# Altium schematic sheet 10 UART&I2C.SchDoc
size 420 x 297 mm
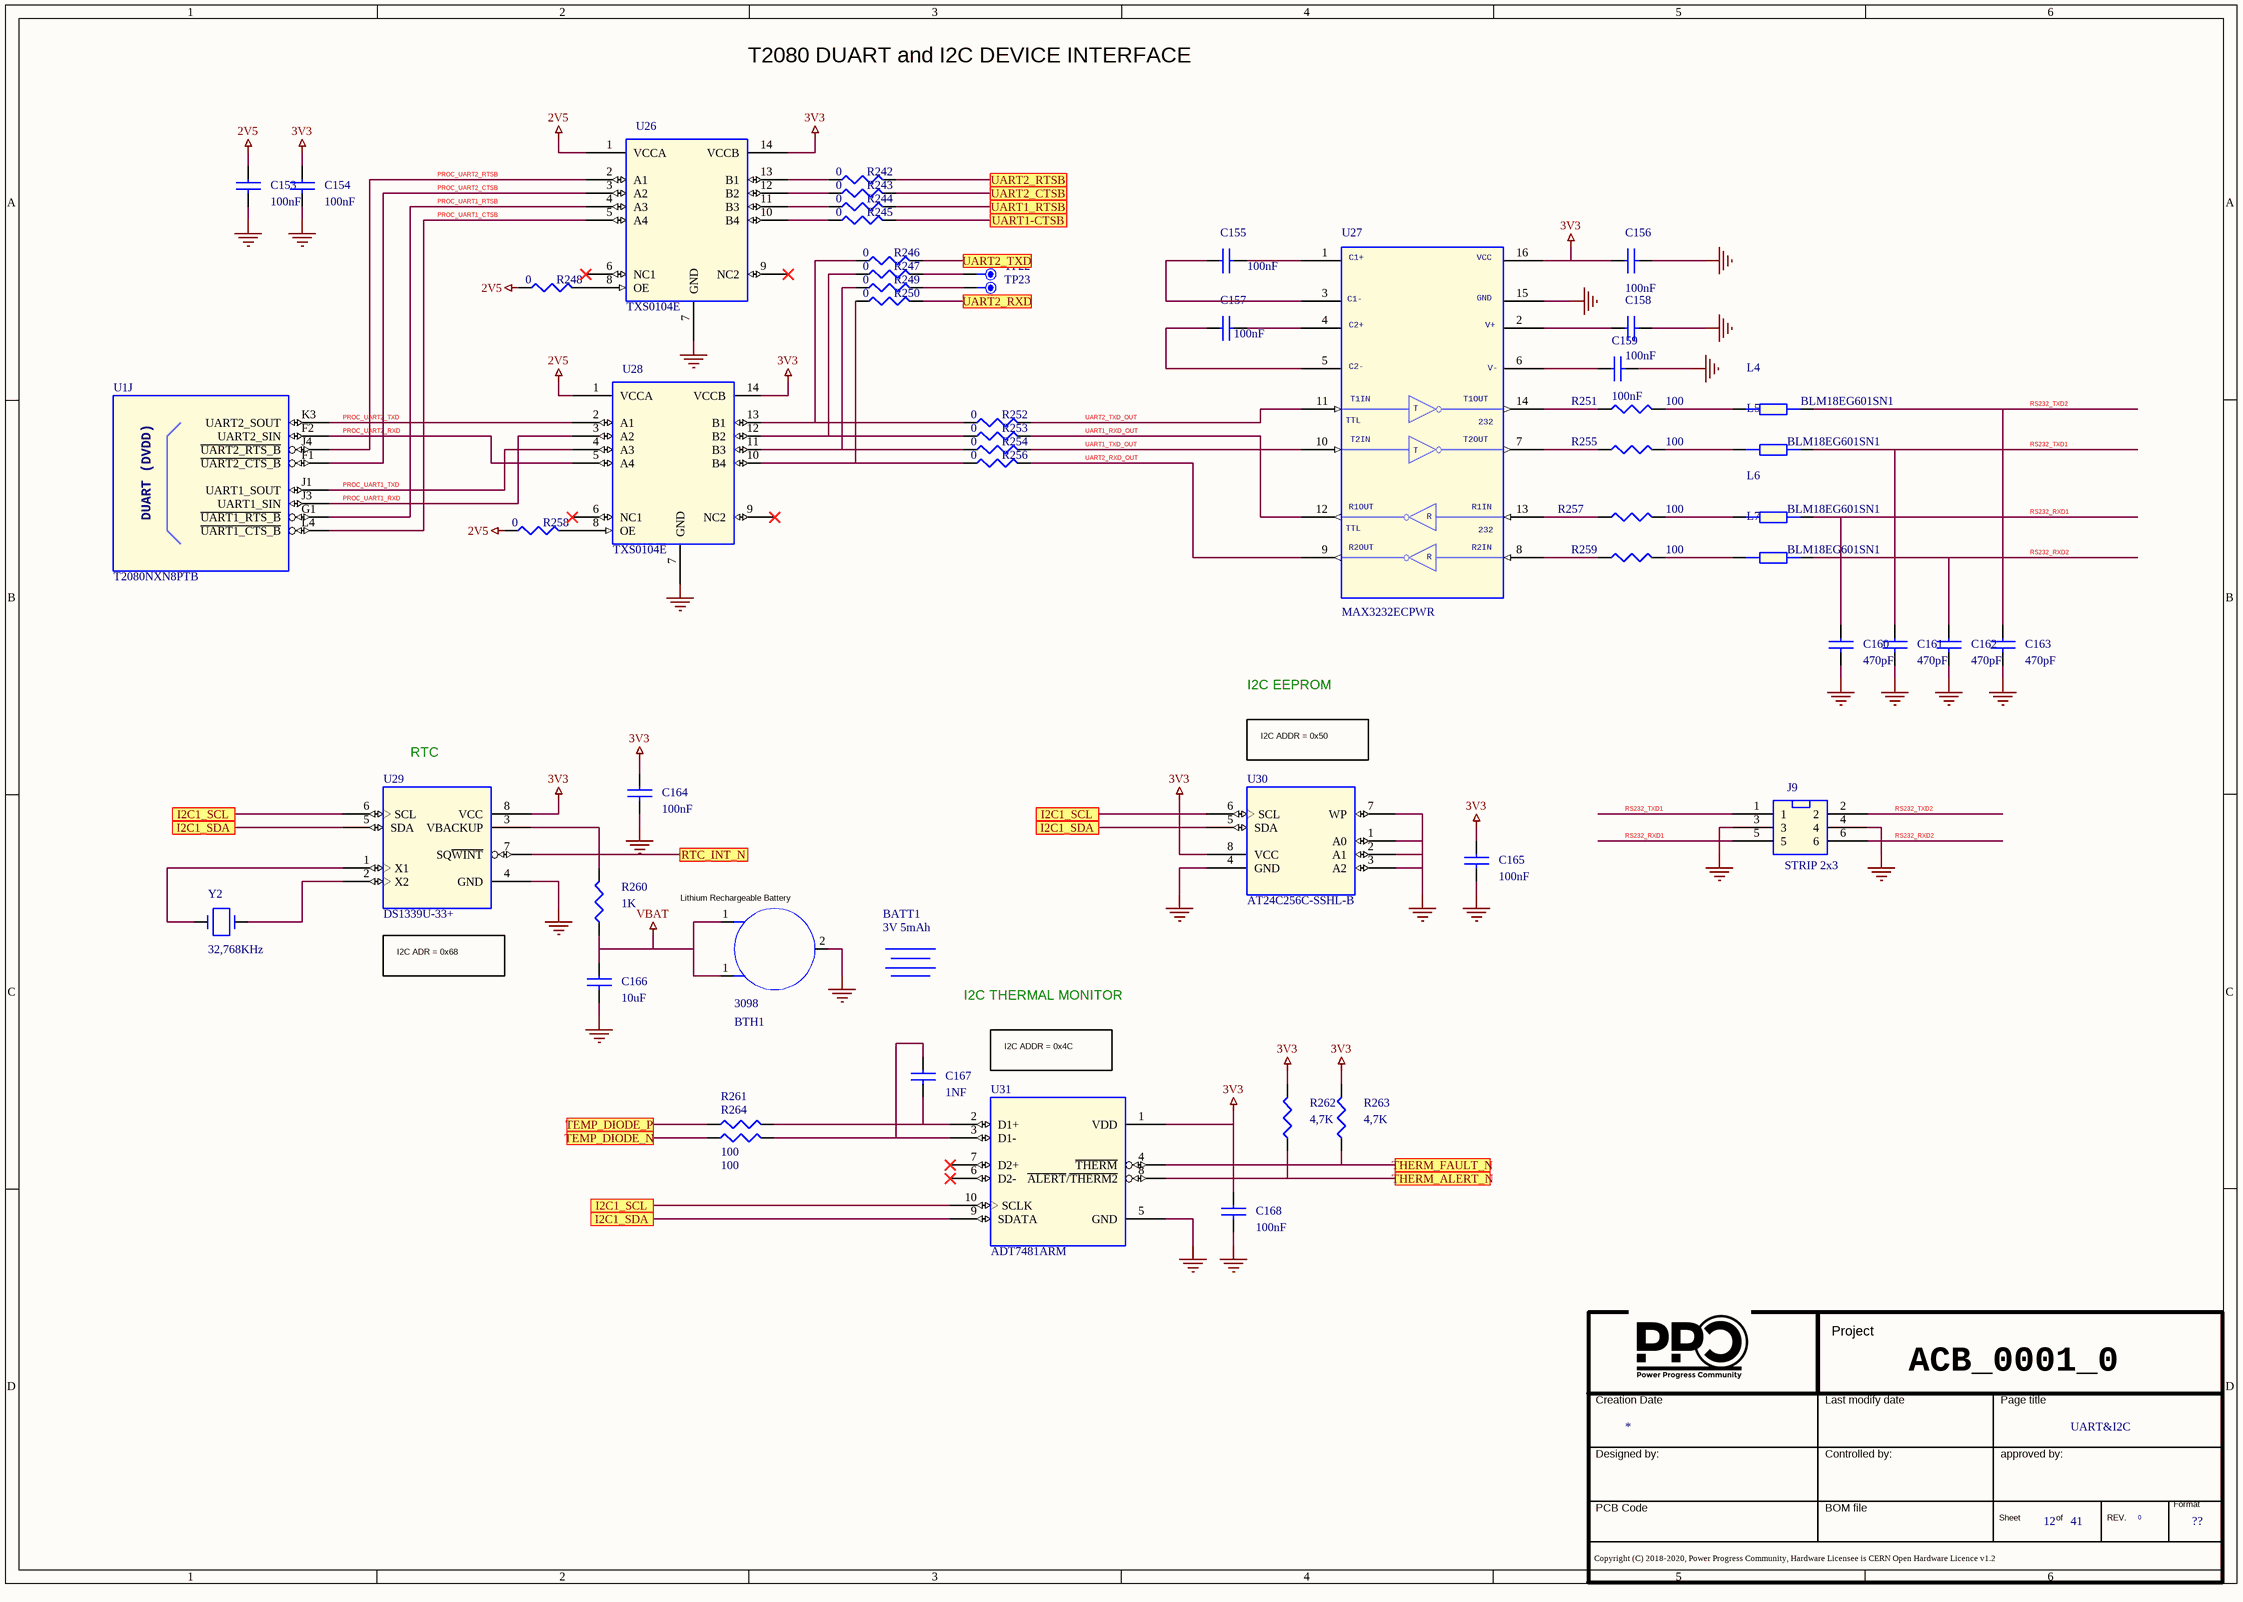
[diagram p0: 10 UART&I2C.SchDoc]

## Parts
*  Doc: UART&I2C  Page Count: 41  Page Number: 12  Page Size: ??  RevCode: 0  (hidden comment: Title_block_PPC)  (graphical)
BATT1  3V 5mAh
BTH1  3098  [SMD 3 PIN]
C153  100nF  [SMD_0402]
C154  100nF  [SMD_0402]
C155  100nF  [SMD_0402]
C156  100nF  [SMD_0402]
C157  100nF  [SMD_0402]
C158  100nF  [SMD_0402]
C159  100nF  [SMD_0402]
C160  470pF  [SMD_0402]
C161  470pF  [SMD_0402]
C162  470pF  [SMD_0402]
C163  470pF  [SMD_0402]
C164  100nF  [SMD_0402]
C165  100nF  [SMD_0402]
C166  10uF  [SMD_0603]
C167  1NF  [SMD_0402]
C168  100nF  [SMD_0402]
J9  STRIP 2x3  [SMT]
L4  BLM18EG601SN1  [SMD_0603]
L5  BLM18EG601SN1  [SMD_0603]
L6  BLM18EG601SN1  [SMD_0603]
L7  BLM18EG601SN1  [SMD_0603]
R242  0  [SMD_0402]
R243  0  [SMD_0402]
R244  0  [SMD_0402]
R245  0  [SMD_0402]
R246  0  [SMD_0402]
R247  0  [SMD_0402]
R248  0  [SMD_0402]
R249  0  [SMD_0402]
R250  0  [SMD_0402]
R251  100  [SMD_0402]
R252  0  [SMD_0402]
R253  0  [SMD_0402]
R254  0  [SMD_0402]
R255  100  [SMD_0402]
R256  0  [SMD_0402]
R257  100  [SMD_0402]
R258  0  [SMD_0402]
R259  100  [SMD_0402]
R260  1K  [SMD_0402]
R261  100  [SMD_0402]
R262  4,7K  [SMD_0402]
R263  4,7K  [SMD_0402]
R264  100  [SMD_0402]
TP22  TPS  [TPS]  (value not drawn)
TP23  TPS  [TPS]  (value not drawn)
U1  T2080NXN8PTB  [bga]  (part J of 14)
U26  TXS0104E  [TSSOP14]
U27  MAX3232ECPWR  [TSSOP16]
U28  TXS0104E  [TSSOP14]
U29  DS1339U-33+  [USOP8]
U30  AT24C256C-SSHL-B  [so_8]
U31  ADT7481ARM  [msop_10]
Y2  32,768KHz  [SMD_3215]

## Ports
I2C1_SCL, I2C1_SDA, RTC_INT_N, TEMP_DIODE_N, TEMP_DIODE_P, THERM_ALERT_N, THERM_FAULT_N, UART1-CTSB, UART1_RTSB, UART2_CTSB, UART2_RTSB, UART2_RXD, UART2_TXD

## Nets
2V5: C153.1 R248.2 R258.2 U26.1(VCCA) U28.1(VCCA)
3V3: C154.1 C156.1 C164.1 C165.1 C168.1 R262.2 R263.2 U26.14(VCCB) U27.16(VCC) U28.14(VCCB) U29.8(VCC) U30.8(VCC) U31.1(VDD)
GND: BTH1.2(2NEG) C153.2 C154.2 C156.2 C158.2 C159.2 C160.2 C161.2 C162.2 C163.2 C164.2 C165.2 C166.2 C168.2 J9.3 J9.4 U26.7(GND) U27.15(GND) U28.7(GND) U29.4(GND) U30.1(A0) U30.2(A1) U30.3(A2) U30.4(GND) U30.7(WP) U31.5(GND)
VBAT: BTH1.1(1POS) C166.1 R260.1
I2C1_SCL: U29.6(SCL) U30.6(SCL) U31.10(SCLK) ; port I2C1_SCL
I2C1_SDA: U29.5(SDA) U30.5(SDA) U31.9(SDATA) ; port I2C1_SDA
PROC_UART1_CTSB: U1.L4(~{UART1_CTS_B}) U26.5(A4)
PROC_UART1_RTSB: U1.G1(~{UART1_RTS_B}) U26.4(A3)
PROC_UART1_RXD: U1.J3(UART1_SIN) U28.3(A2)
PROC_UART1_TXD: U1.J1(UART1_SOUT) U28.4(A3)
PROC_UART2_CTSB: U1.F1(~{UART2_CTS_B}) U26.3(A2)
PROC_UART2_RTSB: U1.J4(~{UART2_RTS_B}) U26.2(A1)
PROC_UART2_RXD: U1.F2(UART2_SIN) U28.5(A4)
PROC_UART2_TXD: U1.K3(UART2_SOUT) U28.2(A1)
RS232_RXD1: C160.1 J9.5 L6.2
RS232_RXD2: C162.1 J9.6 L7.2
RS232_TXD1: C161.1 J9.1 L5.2
RS232_TXD2: C163.1 J9.2 L4.2
RTC_INT_N: U29.7(SQ~{WINT}) ; port RTC_INT_N
TEMP_DIODE_N: R264.1 ; port TEMP_DIODE_N
TEMP_DIODE_P: R261.1 ; port TEMP_DIODE_P
THERM_ALERT_N: R262.1 U31.8(~{ALERT}/~{THERM2}) ; port THERM_ALERT_N
THERM_FAULT_N: R263.1 U31.4(~{THERM}) ; port THERM_FAULT_N
UART1-CTSB: R245.1 ; port UART1-CTSB
UART1_RTSB: R244.1 ; port UART1_RTSB
UART1_RXD_OUT: R253.1 U27.12
UART1_TXD_OUT: R254.1 U27.10
UART2_CTSB: R243.1 ; port UART2_CTSB
UART2_RTSB: R242.1 ; port UART2_RTSB
UART2_RXD: R250.1 ; port UART2_RXD
UART2_RXD_OUT: R256.1 U27.9
UART2_TXD: R246.1 ; port UART2_TXD
UART2_TXD_OUT: R252.1 U27.11
NetC155_1: C155.1 U27.3
NetC155_2: C155.2 U27.1
NetC157_1: C157.1 U27.5
NetC157_2: C157.2 U27.4
NetC158_1: C158.1 U27.2
NetC159_1: C159.1 U27.6
NetC167_1: C167.1 R264.2 U31.3(D1-)
NetC167_2: C167.2 R261.2 U31.2(D1+)
NetL4_1: L4.1 R251.2
NetL5_1: L5.1 R255.2
NetL6_1: L6.1 R257.2
NetL7_1: L7.1 R259.2
NetR242_2: R242.2 U26.13(B1)
NetR243_2: R243.2 U26.12(B2)
NetR244_2: R244.2 U26.11(B3)
NetR245_2: R245.2 U26.10(B4)
NetR246_2: R246.2 R252.2 U28.13(B1)
NetR247_1: R247.1 TP22.1
NetR247_2: R247.2 R253.2 U28.12(B2)
NetR248_1: R248.1 U26.8(OE)
NetR249_1: R249.1 TP23.1
NetR249_2: R249.2 R254.2 U28.11(B3)
NetR250_2: R250.2 R256.2 U28.10(B4)
NetR251_1: R251.1 U27.14
NetR255_1: R255.1 U27.7
NetR257_1: R257.1 U27.13
NetR258_1: R258.1 U28.8(OE)
NetR259_1: R259.1 U27.8
NetR260_2: R260.2 U29.3(VBACKUP)
NetU29_1: U29.1(X1) Y2.1
NetU29_2: U29.2(X2) Y2.2

Not connected (* = marked no-connect by the designer): U26 6(NC1)* 9(NC2)*; U28 6(NC1)* 9(NC2)*; U31 6(D2-)* 7(D2+)*

## Notes on the sheet
- T2080 DUART and I2C DEVICE INTERFACE
- I2C EEPROM
- (near U29) RTC
- I2C ADDR = 0x50
- (near BTH1) Lithium Rechargeable Battery
- I2C ADR = 0x68
- I2C THERMAL MONITOR
- I2C ADDR = 0x4C
- ACB_0001_0
- (in symbol MAX3232E) C1+; C1-; C2+; V+; C2-; V-; T1IN; T1OUT; T; TTL; 232; T2IN; T2OUT; R1OUT; R1IN; R; R2OUT; R2IN
- (in symbol T2080, part J) DUART (DVDD)
- (in symbol Title_block_PPC) Project; Creation Date; Last modify date; Page title; Designed by:; Controlled by:; approved by:; Format; PCB Code; BOM file; Sheet; of; REV.; Copyright (C) 2018-2020, Power Progress Community, Hardware Licensee is CERN Open Hardware Licence v1.2

## Library data of the parts
* = Title_block_PPC: Title: T2080PCIe; Schematic Page Count: 45; Schematic Page Number: 14; Author: MICETEK; Page Create Date: March  8, 1995; Page Title: ?; Page Modify Date: *
BATT1 = BATT_BUTTON: BATTERY LITHIUM COIN 3V 6.8mm Rechargable; Part Number: DA CODIFICARE; Manufacturer 1: Panasonic - BSG; Manufacturer Part Number 1: ML-621S/ZTN; Part Type: BATTERIA; Distributor 1: DIGIKEY (P007-ND)
BTH1 = BATT_HOLDER_PTH_1: HOLDER 6.8mm COIN CELL HLD SMD; Manufacturer 1: Keystone Electronics; Part Number: DA CODIFICARE; RSM: BATT-BH3098; Distributor 1: FARNELL (1889421); Manufacturer Part Number 1: 3098; Part Type: BATTHOLDER\SMD; Tecno77: BATT-BH3098; PCB Footprint: SMD 3 PIN
C153-C155 C158 C159 C165 C168 = CAP NP_Dup2: COND.CER. 100NF 50V 0402 X7R SMD; Manufacturer Part Number 1: CGA2B3X7R1H104M050BD; Manufacturer 1: TDK; Part Number: PASSIVE_24; RSM: RC0402; PCB Footprint: SMD_0402; Part Type: Capacitors\Ceramic\SMD\0402
C156 C157 C164 = CAP NP_Dup2: COND.CER. 100NF 50V 0402 X7R SMD; Part Number: PASSIVE_24; Manufacturer 1: TDK; Manufacturer Part Number 1: CGA2B3X7R1H104M050BD; RSM: RC0402; PCB Footprint: SMD_0402; Part Type: Capacitors\Ceramic\SMD\0402
C160-C163 = CAP NP_Dup2: COND.CER. 470PF 50V 0402 NPO SMD; Part Number: PASSIVE_83; Manufacturer 1: Murata; Manufacturer Part Number 1: GRM1555C1H471JA01D; RSM: RC0402; PCB Footprint: SMD_0402; Part Type: Capacitors\Ceramic\SMD\0402
C166 = CAP NP_Dup2: COND.CER.10uF 0603 25V SMD; Manufacturer Part Number 1: CL10A106MA8NRNC; Manufacturer 1: SAMSUNG; Part Number: PASSIVE_124; RSM: RC0603; PCB Footprint: SMD_0603; Part Type: Capacitors\Ceramic\SMD\0603
C167 = CAP NP_Dup2: COND.CER. 1NF 50V 0402 X7R SMD; Manufacturer Part Number 1: GRM15XR71H102KA86D; Manufacturer 1: Murata; Part Number: PASSIVE_47; RSM: RC0402; PCB Footprint: SMD_0402; Part Type: Capacitors\Ceramic\SMD\0402
J9 = HEADER_2x3: STRIP MASC.2x3P CS.p=2.54mm; Part Number: CONNECTORS_488; Manufacturer 1: TE CONNECTIVITY / AMP; Manufacturer Part Number 1: 9689567RL; PCB Footprint: 2.54mm; RSM: PIN-100MLS-6DL; Part Type: Strip\Terminal
L4 L5 L7 = FERRITE_BEAD: FERRITE BEAD 600ohm 500mA 0603 SMD; Manufacturer Part Number 1: BLM18EG601SN1 SMD; Manufacturer 1: Murata; Part Number: PASSIVE_377; RSM: RC0603; PCB Footprint: SMD_0603; Part Type: Ferrite Beads\SMD\0603
L6 = FERRITE_BEAD: FERRITE BEAD 600ohm 500mA 0603 SMD; Part Number: PASSIVE_377; Manufacturer 1: Murata; Manufacturer Part Number 1: BLM18EG601SN1 SMD; RSM: RC0603; PCB Footprint: SMD_0603; Part Type: Ferrite Beads\SMD\0603
R242-R250 R258 = R_Dup8: RESIS.CHIP 0R 5% 0402 SMD; Manufacturer 1: ROYAL OHM; Part Number: PASSIVE_805; RSM: RC0402; Distributor 1: CAMEL ELETTRONICA SRL  #; Manufacturer Part Number 1: RESIS.CHIP 0R 5% 0402 SMD; Part Type: Resistors\Fixed\SMD\0402\5%; PCB Footprint: SMD_0402
R251 R255 R257 R259 = R_Dup5: RESIS.CHIP 100R 5% 0402 SMD; Manufacturer 1: ROYAL OHM; Part Number: PASSIVE_812; RSM: RC0402; PCB Footprint: SMD_0402; Manufacturer Part Number 1: RESIS.CHIP 100R 5% 0402 SMD; Part Type: Resistors\Fixed\SMD\0402\5%
R252-R254 R256 = R_Dup8: RESIS.CHIP 0R 5% 0402 SMD; Part Number: PASSIVE_805; Manufacturer 1: ROYAL OHM; RSM: RC0402; Part Type: Resistors\Fixed\SMD\0402\5%; Manufacturer Part Number 1: RESIS.CHIP 0R 5% 0402 SMD; Distributor 1: CAMEL ELETTRONICA SRL  #; PCB Footprint: SMD_0402
R260 = R_Dup5: RESIS.CHIP 1K 1% 0402 SMD; Part Number: PASSIVE_628; Manufacturer 1: ROYAL OHM; RSM: RC0402; PCB Footprint: SMD_0402; Part Type: Resistors\Fixed\SMD\0402\1%; Manufacturer Part Number 1: RESIS.CHIP 1K 1% 0402 SMD
R261 R264 = R_Dup5: RESIS.CHIP 100R 5% 0402 SMD; Part Number: PASSIVE_812; Manufacturer 1: ROYAL OHM; RSM: RC0402; PCB Footprint: SMD_0402; Part Type: Resistors\Fixed\SMD\0402\5%; Manufacturer Part Number 1: RESIS.CHIP 100R 5% 0402 SMD
R262 R263 = R_Dup5: RESIS.CHIP 4,7K 5% 0402 SMD; Part Number: PASSIVE_861; Manufacturer 1: ROYAL OHM; RSM: RC0402; Part Type: Resistors\Fixed\SMD\0402\5%; Manufacturer Part Number 1: RESIS.CHIP 4,7K 5% 0402 SMD; PCB Footprint: SMD_0402
TP22 TP23 = TPS_2: Test Point, .025 sq pin; Mfr_Part_Number: Cut From Strip; MFR_Name: Samtec; PCB Footprint: tp36; RSM: AE-TESTPOINT; Distributor_Part_Number: no parts needed
U1 = T2080: QRIQ MPU 1.87GT/s DDR3/3L 4x10GE; Part Number: MICROPROCESSOR_65; Manufacturer 1: NXP; Vendor: Freescale; PCB Footprint: BGA896; RSM: PBGA896-0_8MM-26X25; TYPE: IC; MPN: T2080; Part Type: 32 BIT; Manufacturer Part Number 1: T2080NXN8PTB; Distributor 1: MOUSER(841-T2080NXN8PTB)
U26 U28 = TXS0104E: BIDIRECTIONAL VOLTAGE-LEVEL TRANSLATOR; Manufacturer Part Number 1: TXS0104EPWR; Manufacturer 1: TEXAS; Part Number: LOGIC_264; RSM: TSSOP-14; Distributor 1: TI.COM; Part Type: TRANSLATOR; PCB Footprint: TSSOP14
U27 = MAX3232E: IC RS232 3V-5.5V DRVR 16-TSSOP; Part Number: LOGIC_60; Manufacturer 1: TEXAS; RSM: TSSOP-16; Part Type: Drivers\RS-232; PCB Footprint: TSSOP16; Manufacturer Part Number 1: MAX3232ECPWR; Distributor 1: DIGIKEY (296-19263-2-ND)
U29 = DS1339U: IC RTC CLK/CALENDAR I2C 8-USOP; Manufacturer 1: Maxim; Part Number: LOGIC_355; RSM: USOP-8; Distributor 1: DIGIKEY(DS1339U-33+-ND); Manufacturer Part Number 1: DS1339U-33+; PCB Footprint: USOP8; Part Type: RTC; Vendor: Maxim; TYPE: IC; MPN: DS1339U-33+
U30 = EEPROM-I2C: EEPROM 256K (32K X 8), 2-WI 1.8V; Manufacturer 1: MICROCHIP; Part Number: MEMORIES_105; RSM: SO-8; Vendor: Atmel; PCB Footprint: SOIC-8; Distributor 1: MOUSER(556-AT24C256C-SSHL-B); Manufacturer Part Number 1: AT24C256C-SSHL-B; Part Type: EEPROM; TYPE: IC; MPN: AT24C256C-SSHL-B
U31 = ADT7481: 2 CH TEMP SNSR/ALARM 2 WIRE; Manufacturer Part Number 1: ADT7481ARMZ-REEL; Manufacturer 1: ON Semi; Part Number: LOGIC_361; PCB Footprint: MSOP-10; Distributor 1: MOUSER(863-ADT7481ARMZ-REEL); Part Type: I2C\TEMP_SENSOR; TYPE: IC; MPN: ADT7481ARMZ-REEL; Vendor: ON Semi; RSM: MSOP-10
Y2 = CRYSTAL: CRYSTAL 32.768KHZ 12.5PF SMD; Part Number: MISC_129; Manufacturer 1: TXC; Manufacturer Part Number 1: 9HT10-32.768KBZF-T; RSM: XC-ABS07; Part Type: Quartz; Distributor 1: DIGIKEY(887-1573-1-ND); PCB Footprint: SMD_3215